# Altium schematic sheet EntradaDiferencial.SchDoc
size A4
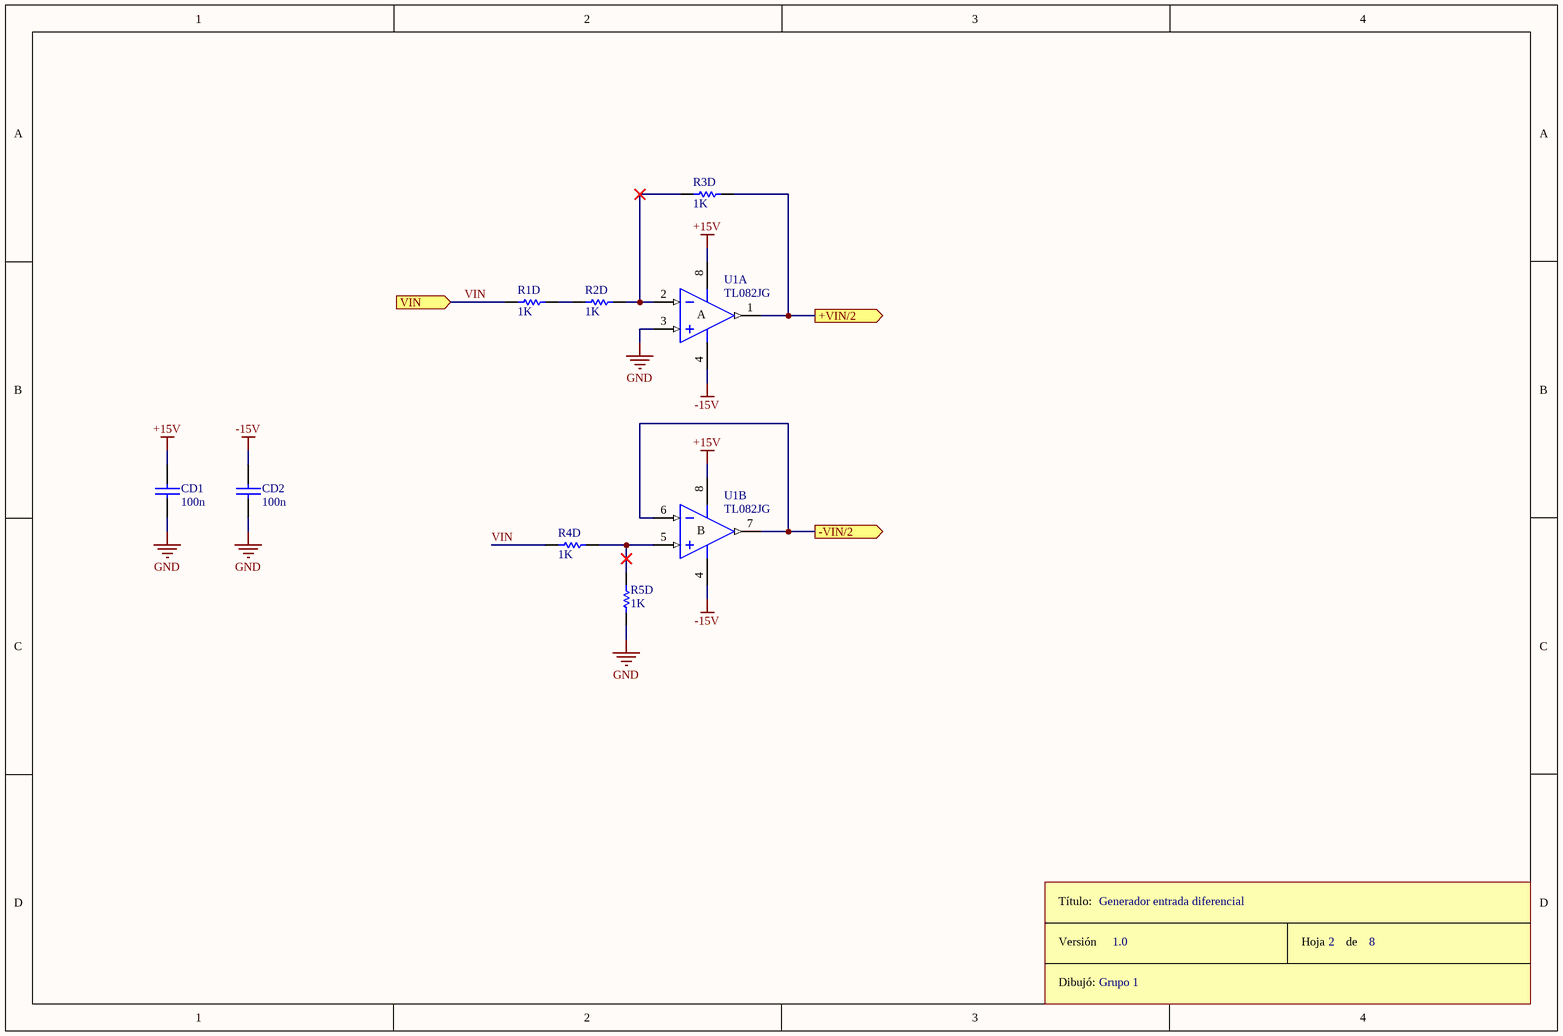
[diagram p0: EntradaDiferencial.SchDoc]

## Parts
CD1  100n  [CAP100]
CD2  100n  [CAP100]
R1D  1K  [RES300]
R2D  1K  [RES300]
R3D  1K  [RES300]
R4D  1K  [RES300]
R5D  1K  [RES300]
ROT1  Rótulo  (value not drawn)
U1  TL082JG  [JG008]  (parts A,B of 2)

## Ports
+VIN/2 (out), -VIN/2 (out), VIN (in)

## Nets
+15V: CD1.1 U1.8(V+)
-15V: CD2.1 U1.4(V-)
GND: CD1.2 CD2.2 R5D.1 U1.3(IN+)
+VIN/2: R3D.2 U1.1(OUT) ; port +VIN/2
-VIN/2: U1.6(IN-) U1.7(OUT) ; port -VIN/2
VIN: R1D.2 R4D.2 ; port VIN
NetR1D_1: R1D.1 R2D.1
NetR2D_2: R2D.2 R3D.1 U1.2(IN-)
NetR4D_1: R4D.1 R5D.2 U1.5(IN+)

## Notes on the sheet
- Generador entrada diferencial
- Grupo 1
- 1.0
- 2
- 8
- (in symbol Rótulo) Título:; Versión; Hoja       de; Dibujó:
- (in symbol TL082JG, part A) A
- (in symbol TL082JG, part B) B

## Library data of the parts
CD1 CD2 = CAP
R1D R2D R3D R4D R5D = RES
U1 = TL082JG: JFET-Input Operational Amplifier; Published: 16-Jan-2001; LatestRevisionDate: 04-Mar-2005; LatestRevisionNote: Stylized 3D Model Added.; DatasheetVersion: Feb-1999; PackageVersion: Jan-1995; PackageReference: JG008; Publisher: Altium Limited; PackageDescription: DIP; 8 Leads; Row Spacing 7.62 mm; Pitch 2.54 mm; ComponentLink1Description: Manufacturer Link; ComponentLink1URL: http://www.ti.com/; ComponentLink2Description: Datasheet; ComponentLink2URL: http://www-s.ti.com/sc/ds/tl082.pdf